# EAGLE design telecommande (EAGLE 8.0.2)
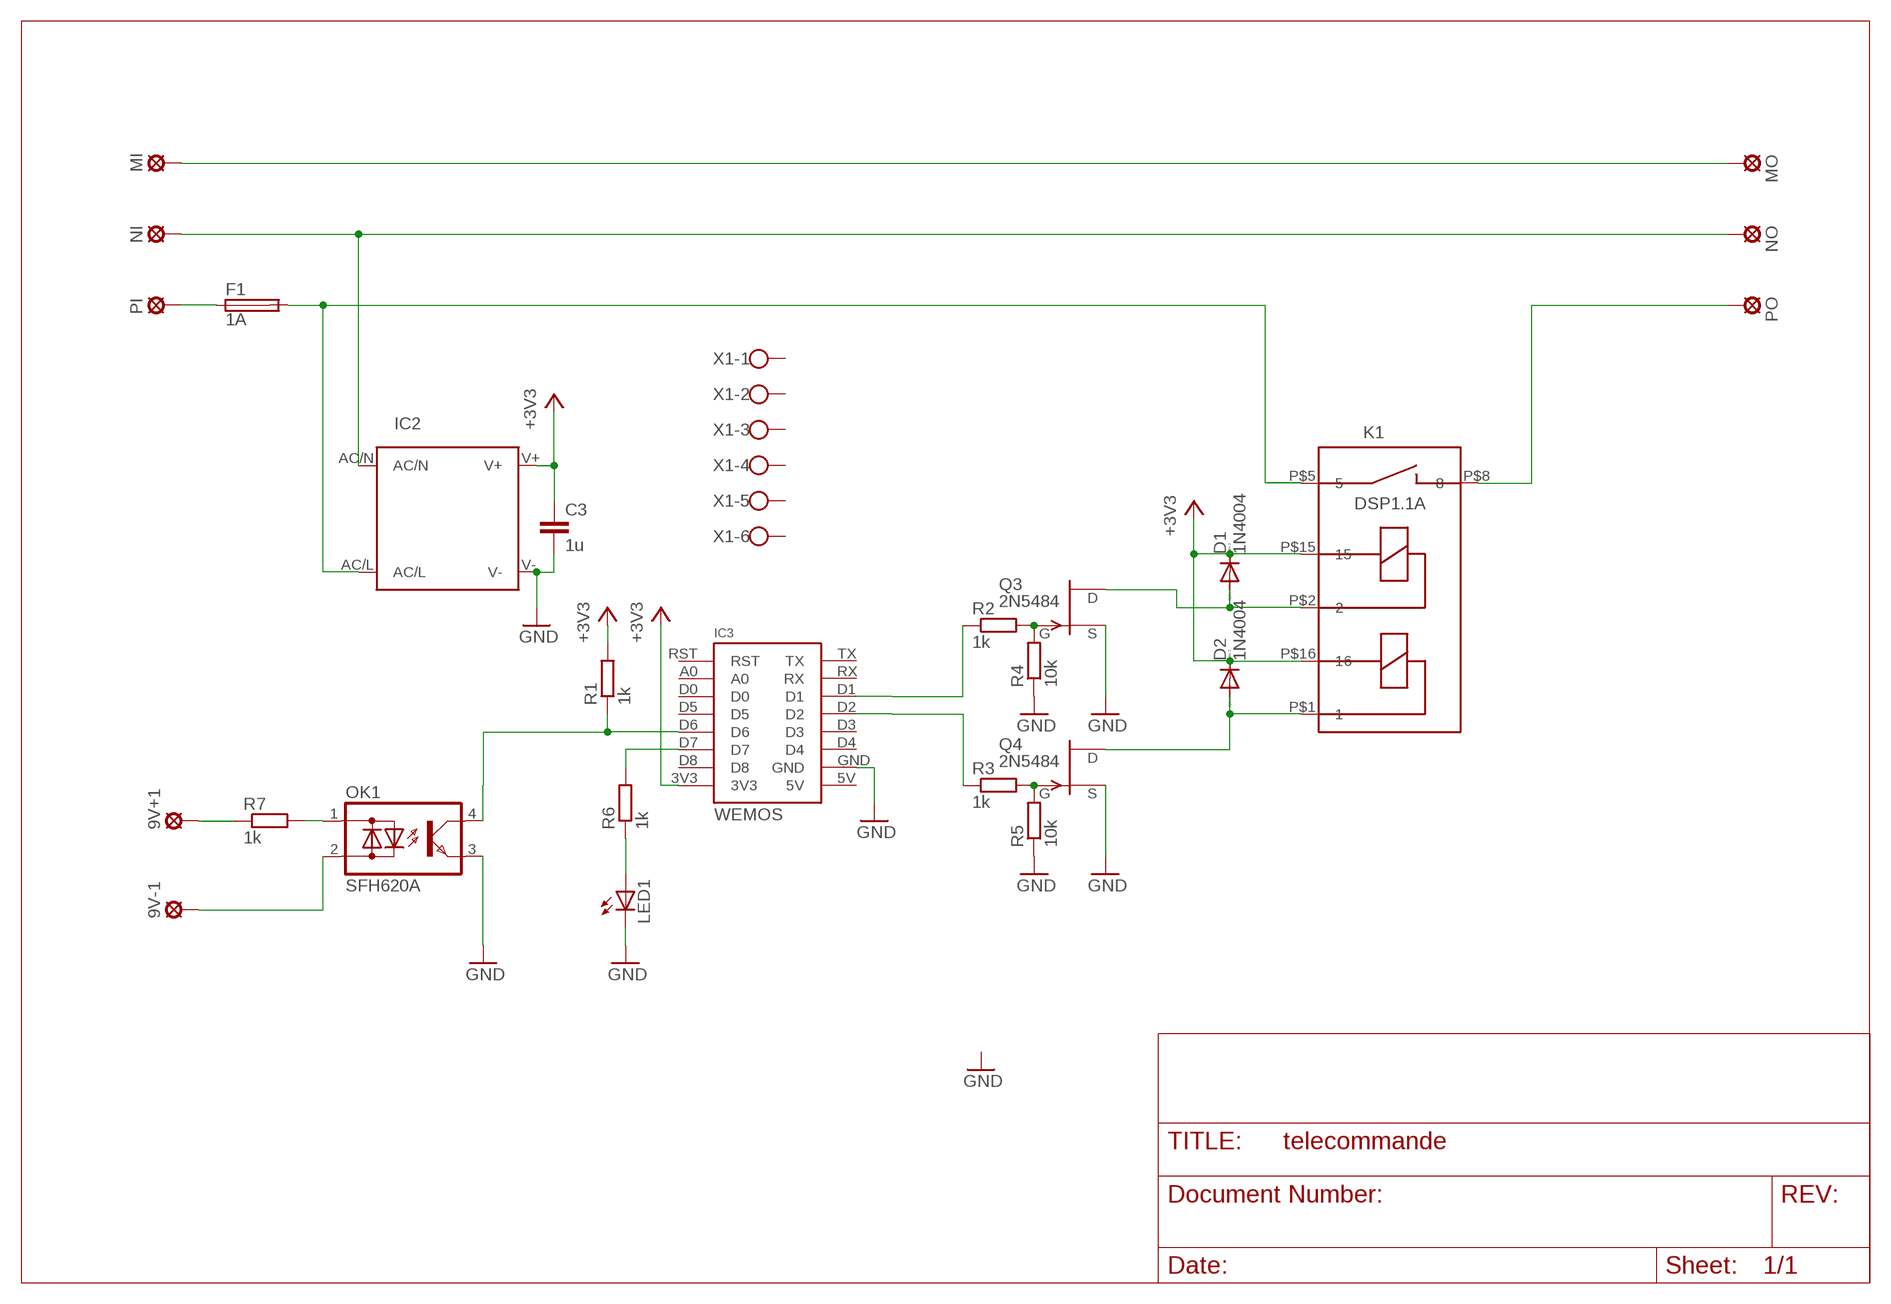
[diagram p0: schematic, sheet 1]

## Parts
9V+1  LSP13  [LSP13]
9V-1  LSP13  [LSP13]
C3  1u  C-EU025-024X044  [C025-024X044]
D1  1N4004  [DO41-10]
D2  1N4004  [DO41-10]
F1  1A  GSH15  [GSH15]
IC2  IRM_03  [IRM_03]
IC3  WEMOS  [WEMOS]
K1  DSP1.1A  [DSP1A]
LED1  LED3MM  [LED3MM]
MI  LSP13  [LSP13]
MO  LSP13  [LSP13]
NI  LSP13  [LSP13]
NO  LSP13  [LSP13]
OK1  SFH620A  [DIL04]
PI  LSP13  [LSP13]
PO  LSP13  [LSP13]
Q3  2N5484  [TO92-]
Q4  2N5484  [TO92-]
R1  1k  R-EU_0207/10  [0207/10]
R2  1k  R-EU_0207/10  [0207/10]
R3  1k  R-EU_0207/10  [0207/10]
R4  10k  R-EU_0207/10  [0207/10]
R5  10k  R-EU_0207/10  [0207/10]
R6  1k  R-EU_0207/10  [0207/10]
R7  1k  R-EU_0207/10  [0207/10]
X1  W237-6  [W237-6]

## Nets
+3V3: C3.1 D1.C D2.C IC2.V+ IC3.3V3 K1.P$15 K1.P$16 R1.2
GND: C3.2 IC2.V- IC3.GND LED1.K(C) OK1.3(E) Q3.2(S) Q4.2(S) R4.1 R5.1
MASSE [240V]: MI.MP MO.MP
N [240V]: IC2.AC/N NI.MP NO.MP
N$1: Q3.1(G) R2.2 R4.2
N$2: Q4.1(G) R3.2 R5.2
N$3: D1.A K1.P$2 Q3.3(D)
N$6: D2.A K1.P$1 Q4.3(D)
N$8 [240V]: K1.P$8 PO.MP
N$9: 9V+1.MP R7.1
N$10: LED1.A R6.1
N$11: OK1.1(AC1) R7.2
N$12: IC3.D1 R2.1
N$13: IC3.D2 R3.1
N$14: IC3.D7 R6.2
N$15: 9V-1.MP OK1.2(AC2)
N$16: IC3.D6 OK1.4(C) R1.1
P [240V]: F1.2 IC2.AC/L K1.P$5
PI [240V]: F1.1 PI.MP
Unconnected: IC3.5V IC3.A0 IC3.D0 IC3.D3 IC3.D4 IC3.D5 IC3.D8 IC3.RST IC3.RX IC3.TX X1.1 X1.2 X1.3 X1.4 X1.5 X1.6

## Library data of the parts
9V+1 9V-1 MI MO NI NO PI PO = solpad:LSP13: SOLDER PAD drill 1.3 mm, distributor Buerklin, 12H562
C3 = rcl:C-EU: CAPACITOR, European symbol
D1 D2 = diode:1N4004: DIODE general purpose rectifier, 1 A
F1 = fuse:GSH15: FUSE HOLDER grid 15mm, 19649 Wickmann; MPN: 64900001039; OC_FARNELL: 1271673; OC_NEWARK: 02P0318
IC2 = meanwell_irm_v6:IRM_03: 3 watt IRM 03 Vout [V] Imax [A] Pmax [W] Eff [%] 3.3 0.9 3 68 5 0.6 3 72 9 0.33 3 77 12 0.25 3 78 15 0.2 3 78 24 0.125 3 80
IC3 = wemos:WEMOS
K1 = nicolas:DSP1.1
LED1 = led:LED: LED OSRAM: - CHIPLED LG R971, LG N971, LY N971, LG Q971, LY Q971, LO R971, LY R971 LH N974, LH R974 LS Q976, LO Q976, LY Q976 LO Q996 - Hyper CHIPLED LW Q18S LB Q993, LB Q99A, LB R99A - SideLED LS A670, LO A670, LY A670, LG A670, LP A670 LB A673, LV A673, LT A673, LW A673 LH A674 LY A675 LS A676, LA A676, LO A676, LY A676, LW A676 LS A679, LY A679, LG A679 - Hyper Micro SIDELED® LS Y876, LA Y876, LO Y876, LY Y876 LT Y87S - SmartLED LW L88C, LW L88S LB L89C, LB L89S, LG L890 LS L89K, LO L89K, LY L89K LS L896, LA L896, LO L896, LY L896 - TOPLED LS T670, LO T670, LY T670, LG T670, LP T670 LSG T670, LSP T670, LSY T670, LOP T670, LYG T670 LG T671, LOG T671, LSG T671 LB T673, LV T673, LT T673, LW T673 LH T674 LS T676, LA T676, LO T676, LY T676, LB T676, LH T676, LSB T676, LW T676 LB T67C, LV T67C, LT T67C, LS T67K, LO T67K, LY T67K, LW E67C LS E67B, LA E67B, LO E67B, LY E67B, LB E67C, LV E67C, LT E67C LW T67C LS T679, LY T679, LG T679 LS T770, LO T770, LY T770, LG T770, LP T770 LB T773, LV T773, LT T773, LW T773 LH T774 LS E675, LA E675, LY E675, LS T675 LS T776, LA T776, LO T776, LY T776, LB T776 LHGB T686 LT T68C, LB T68C - Hyper Mini TOPLED® LB M676 - Mini TOPLED Santana® LG M470 LS M47K, LO M47K, LY M47K Source: http://www.osram.convergy.de LUXEON: - LUMILED® LXK2-PW12-R00, LXK2-PW12-S00, LXK2-PW14-U00, LXK2-PW14-V00 LXK2-PM12-R00, LXK2-PM12-S00, LXK2-PM14-U00 LXK2-PE12-Q00, LXK2-PE12-R00, LXK2-PE12-S00, LXK2-PE14-T00, LXK2-PE14-U00 LXK2-PB12-K00, LXK2-PB12-L00, LXK2-PB12-M00, LXK2-PB14-N00, LXK2-PB14-P00, LXK2-PB14-Q00 LXK2-PR12-L00, LXK2-PR12-M00, LXK2-PR14-Q00, LXK2-PR14-R00 LXK2-PD12-Q00, LXK2-PD12-R00, LXK2-PD12-S00 LXK2-PH12-R00, LXK2-PH12-S00 LXK2-PL12-P00, LXK2-PL12-Q00, LXK2-PL12-R00 Source: www.luxeon.com KINGBRIGHT: KA-3528ASYC Source: www.kingbright.com
OK1 = optocoupler:SFH620: Optocoupler, Phototransistor Output, AC Input Source: http://www.vishay.com/docs/83675/sfh620.pdf; MPN: SFH620A-2; OC_FARNELL: 1469594; OC_NEWARK: 97K9546
Q3 Q4 = transistor-fet:?548*: N-Channel JFETs Source: VISHAY 2N5484.pdf Compatible: TO92 2N5245 J304 J305 U310 J308 J309 J310 TO72 2N4416 2N4416A 2N3823 2N4351 3N169 3N170 3N171 MFE3002 TO18 2N3796 2N3797 MFE825 Source: Motorola European Master Guide Pacge 3-59
R1-R7 = rcl:R-EU_: RESISTOR, European symbol
X1 = con-wago-500:W237-6: WAGO SCREW CLAMP; OC_FARNELL: unknown; OC_NEWARK: unknown

## Net classes
0 default: width 0.61 mm, drill 0.8 mm, clearance 0.61 mm
1 240V: width 1 mm, drill 1 mm, clearance 1 mm

## Board
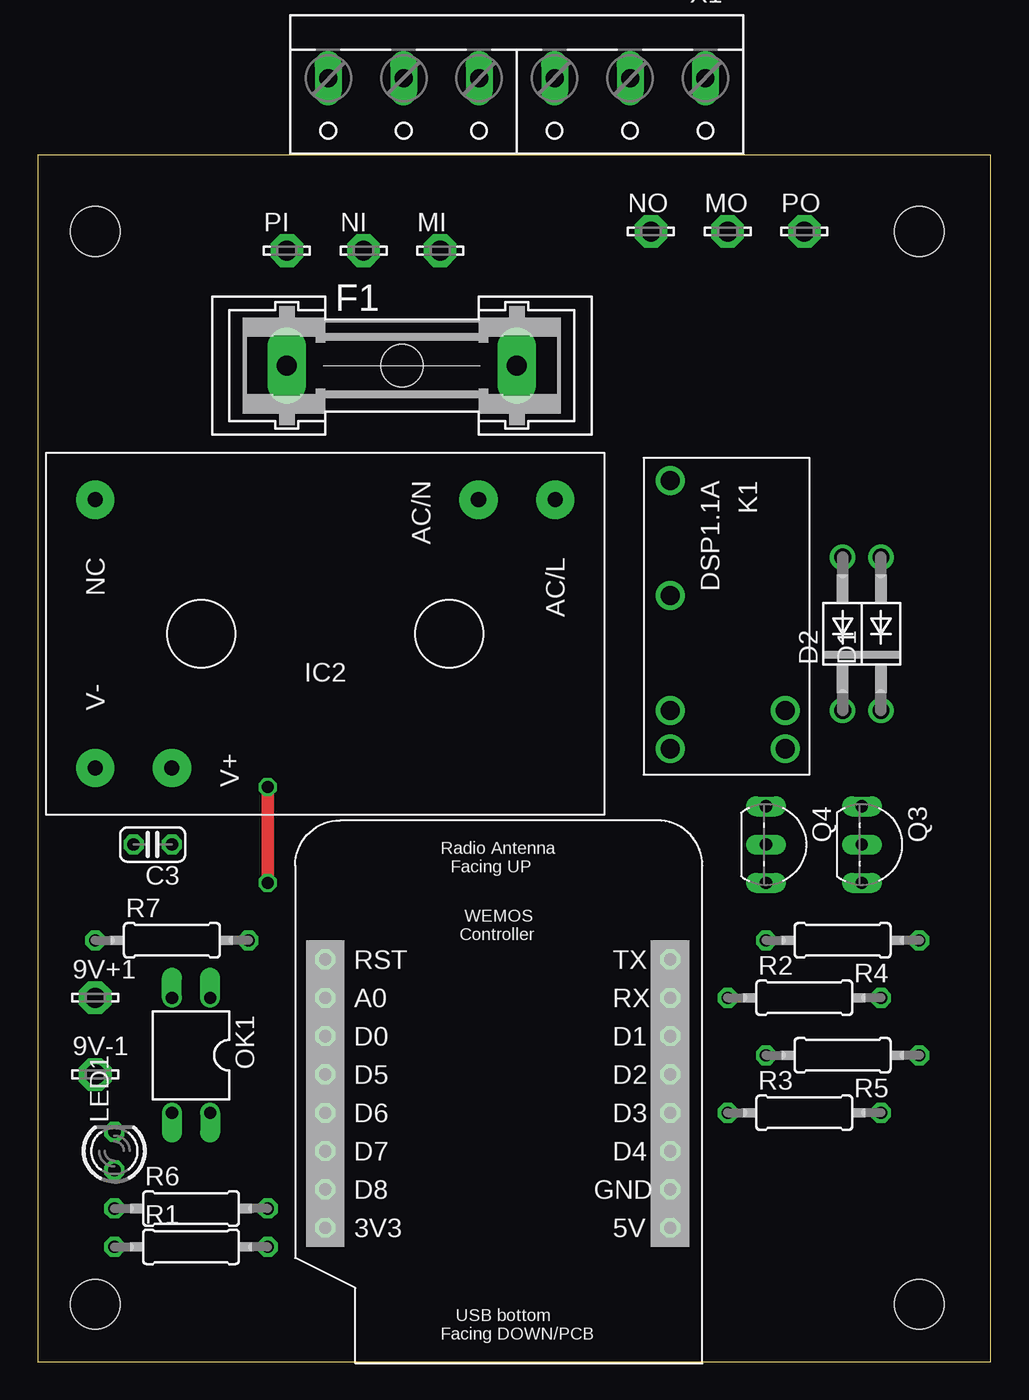
[diagram p1: board, top side]
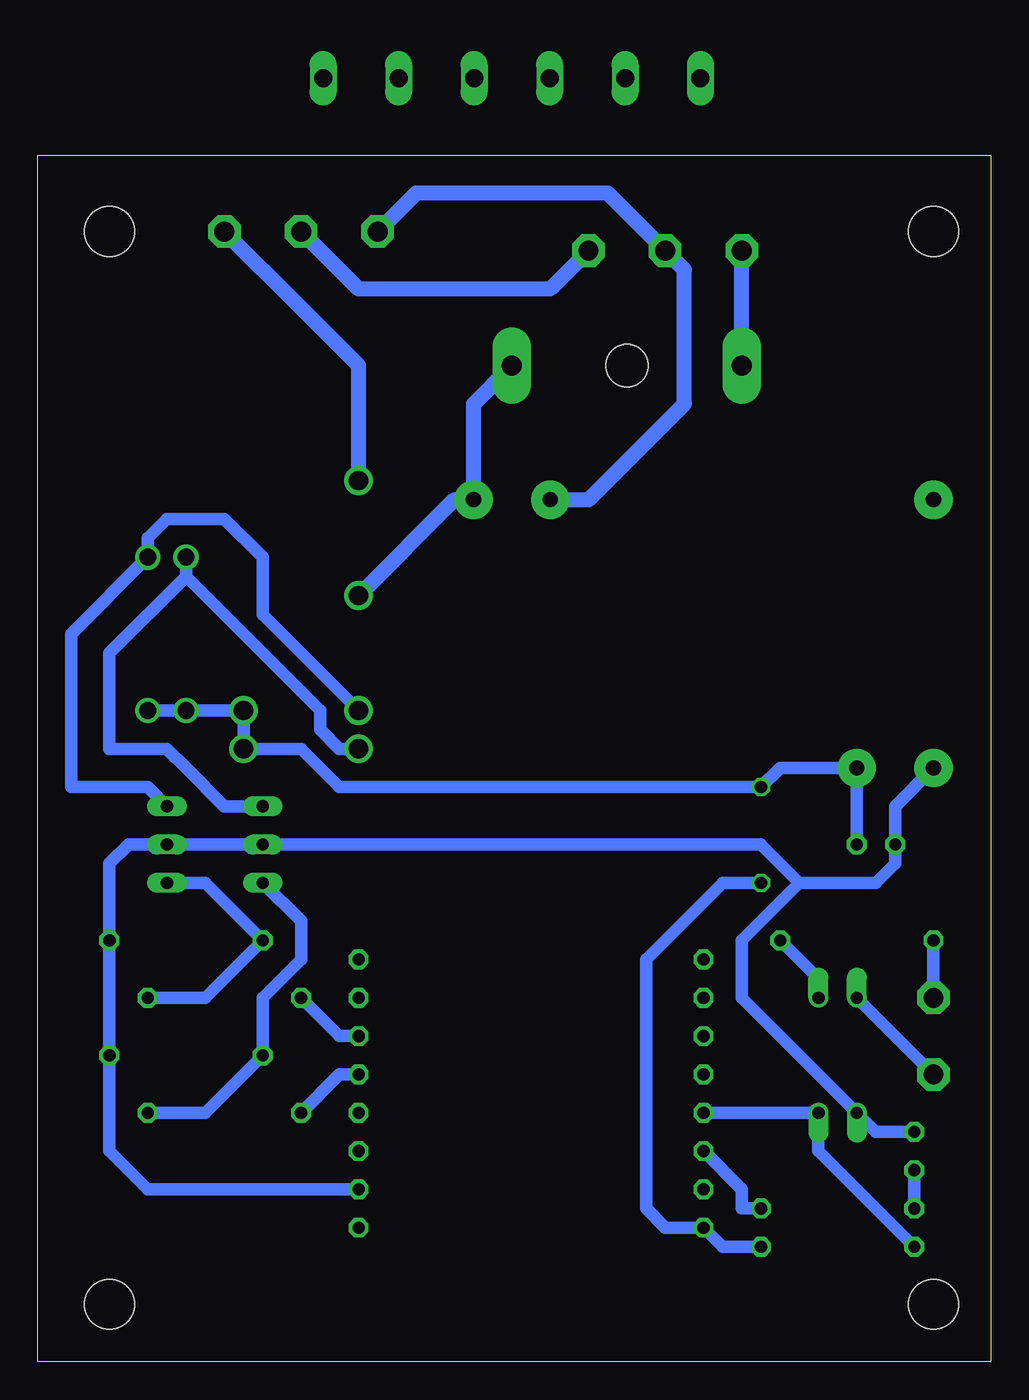
[diagram p2: board, bottom side, seen from below]

Size 63.17 x 80 mm. Coordinates in mm from the lower left corner, seen from the top.
Outline: 0,0 63.17,0 63.17,80 0,80 0,0
Copper layers (1*16): Top 0.035mm / dielectric 1.5mm / Bottom 0.035mm
Design rules "default": minimum track width 10mil, minimum drill 24mil, track to track 8mil, track to pad 8mil, pad to pad 8mil, via to via 8mil, smd to smd 8mil, copper to edge 40mil, drill to drill 8mil, minimum pad ring 10mil, minimum via ring 8mil, stop-mask expansion 4mil, vias tented up to drill 0mil, thermal gap 10mil
Holes 3.3 mm at 3.81,74.93 58.42,74.93 58.42,3.81 3.81,3.81

### Footprints (pad centres in the part's own frame; a part is rotated, then mirrored left to right if it is on the bottom)
LSP13 = drill 1.321 pad 2.159 octagon: MP 0,0
C025-024X044 = drill 0.813 octagon: 1 -1.27,0; 2 1.27,0
DO41-10 = drill 1.118: A 5.08,0; C -5.08,0
GSH15 = drill 1.321 pad 2.54 long: 1 -7.62,0; 2 7.62,0 | hole 2.794: 0,0
IRM_03 = drill 1 pad 2.54: AC/L -15.24,-8.89; AC/N -10.16,-8.89; NC 15.24,-8.89; V+ 10.16,8.89; V- 15.24,8.89
WEMOS = drill 0.8 octagon: 3V3 0,0; 5V 22.86,0; A0 0,15.24; D0 0,12.7; D1 22.86,12.7; D2 22.86,10.16; D3 22.86,7.62; D4 22.86,5.08; D5 0,10.16; D6 0,7.62; D7 0,5.08; D8 0,2.54; GND 22.86,2.54; RST 0,17.78; RX 22.86,15.24; TX 22.86,17.78
DSP1A = drill 1.27: P$1 17.78,0; P$2 15.24,0; P$5 7.62,0; P$8 0,0; P$15 15.24,7.62; P$16 17.78,7.62
LED3MM = drill 0.813 octagon: A -1.27,0; K 1.27,0
DIL04 = drill 0.813 offset: 1 -1.27,-3.81; 2 1.27,-3.81; 3 1.27,3.81; 4 -1.27,3.81
TO92- = drill 0.813 long: 1 2.54,0; 2 0,0; 3 -2.54,0
0207/10 = drill 0.813 octagon: 1 -5.08,0; 2 5.08,0
W237-6 = drill 1.194 long: 1 -12.5,-1.27; 2 -7.5,-1.27; 3 -2.5,-1.27; 4 2.5,-1.27; 5 7.5,-1.27; 6 12.5,-1.27

### Placement (x,y rotation side)
9V+1  3.81,24.13 0 top
9V-1  3.81,19.05 0 top
C3  7.62,34.29 180 top
D1  55.88,48.26 90 top
D2  53.34,48.26 90 top
F1  24.13,66.04 0 top
IC2  19.05,48.26 180 top
IC3  19.05,8.89 0 top
K1  41.91,58.42 270 top
LED1  5.08,13.97 90 top
MI  26.67,73.66 0 top
MO  45.72,74.93 0 top
NI  21.59,73.66 0 top
NO  40.64,74.93 0 top
OK1  10.16,20.32 180 top
PI  16.51,73.66 0 top
PO  50.8,74.93 0 top
Q3  54.61,34.29 270 top
Q4  48.26,34.29 270 top
R1  10.16,7.62 0 top
R2  50.8,24.13 0 top
R3  50.8,16.51 0 top
R4  53.34,27.94 180 top
R5  53.34,20.32 180 top
R6  10.16,10.16 0 top
R7  8.89,27.94 0 top
X1  31.75,83.82 180 top  (outside the outline)

### Tracks (layer width: path | path; a pad name or v marks a point on that pad's centre or on a via)
+3V3  (via drill 0.8)
  Top 0.813: v15.24,31.75 v15.24,38.1
  Bottom 0.813: C3.1 IC2.V+ 13.97,39.37 v15.24,38.1 43.18,38.1 45.72,40.64 K1.P$16 K1.P$15 D2.C D1.C | v15.24,31.75 17.78,31.75 22.86,26.67 22.86,10.16 21.59,8.89 IC3.3V3 17.78,7.62 R1.2
GND
  Bottom 0.813: IC2.V- 6.35,36.83 C3.2 6.35,33.02 7.62,31.75 10.16,31.75 | IC3.GND 55.88,11.43 58.42,13.97 R5.1 R4.1 58.42,33.02 57.15,34.29 Q3.2 Q4.2 16.51,34.29 15.24,34.29 12.7,31.75 | 10.16,31.75 12.7,31.75 | LED1.K 7.62,15.24 OK1.3 16.51,24.13 16.51,27.94 12.7,31.75 | 12.7,31.75 10.16,31.75
MASSE
  Bottom 1: MI.MP 29.21,71.12 41.91,71.12 MO.MP
N
  Bottom 1: NO.MP 38.1,77.47 25.4,77.47 NI.MP 20.32,72.39 20.32,63.5 26.67,57.15 27.94,57.15 IC2.AC/N
N$1
  Bottom 0.813: R2.2 52.07,24.13 R4.2 52.07,31.75 Q3.1
N$2
  Bottom 0.813: R3.2 52.07,16.51 R5.2 48.26,24.13 45.72,26.67 45.72,29.21 Q4.1
N$3
  Bottom 0.813: K1.P$2 48.26,49.53 48.26,53.34 50.8,55.88 53.34,55.88 54.61,55.88 55.88,54.61 D1.A 60.96,48.26 60.96,38.1 57.15,38.1 55.88,38.1 Q3.3
N$6
  Bottom 0.813: 53.34,52.07 45.72,44.45 44.45,43.18 44.45,41.91 43.18,40.64 K1.P$1 | 53.34,52.07 D2.A | Q4.3 50.8,36.83 53.34,39.37 54.61,40.64 58.42,40.64 58.42,46.99 53.34,52.07
N$8
  Bottom 1: K1.P$8 41.91,66.04 45.72,69.85 PO.MP
N$9
  Bottom 0.813: 9V+1.MP R7.1
N$10
  Bottom 0.813: LED1.A 5.08,12.06 5.08,10.79 R6.1
N$11
  Bottom 0.813: R7.2 11.43,25.4 OK1.1
N$12
  Bottom 0.813: IC3.D1 43.18,21.59 R2.1
N$13
  Bottom 0.813: IC3.D2 43.18,19.05 R3.1
N$14
  Bottom 0.813: R6.2 16.51,10.16 16.51,11.43 IC3.D7
N$15
  Bottom 0.813: 9V-1.MP OK1.2
N$16
  Bottom 0.813: R1.1 11.43,13.97 OK1.4 IC3.D6
P
  Bottom 1: K1.P$5 35.56,57.15 IC2.AC/L 34.29,63.5 F1.2
PI
  Bottom 1: F1.1 PI.MP